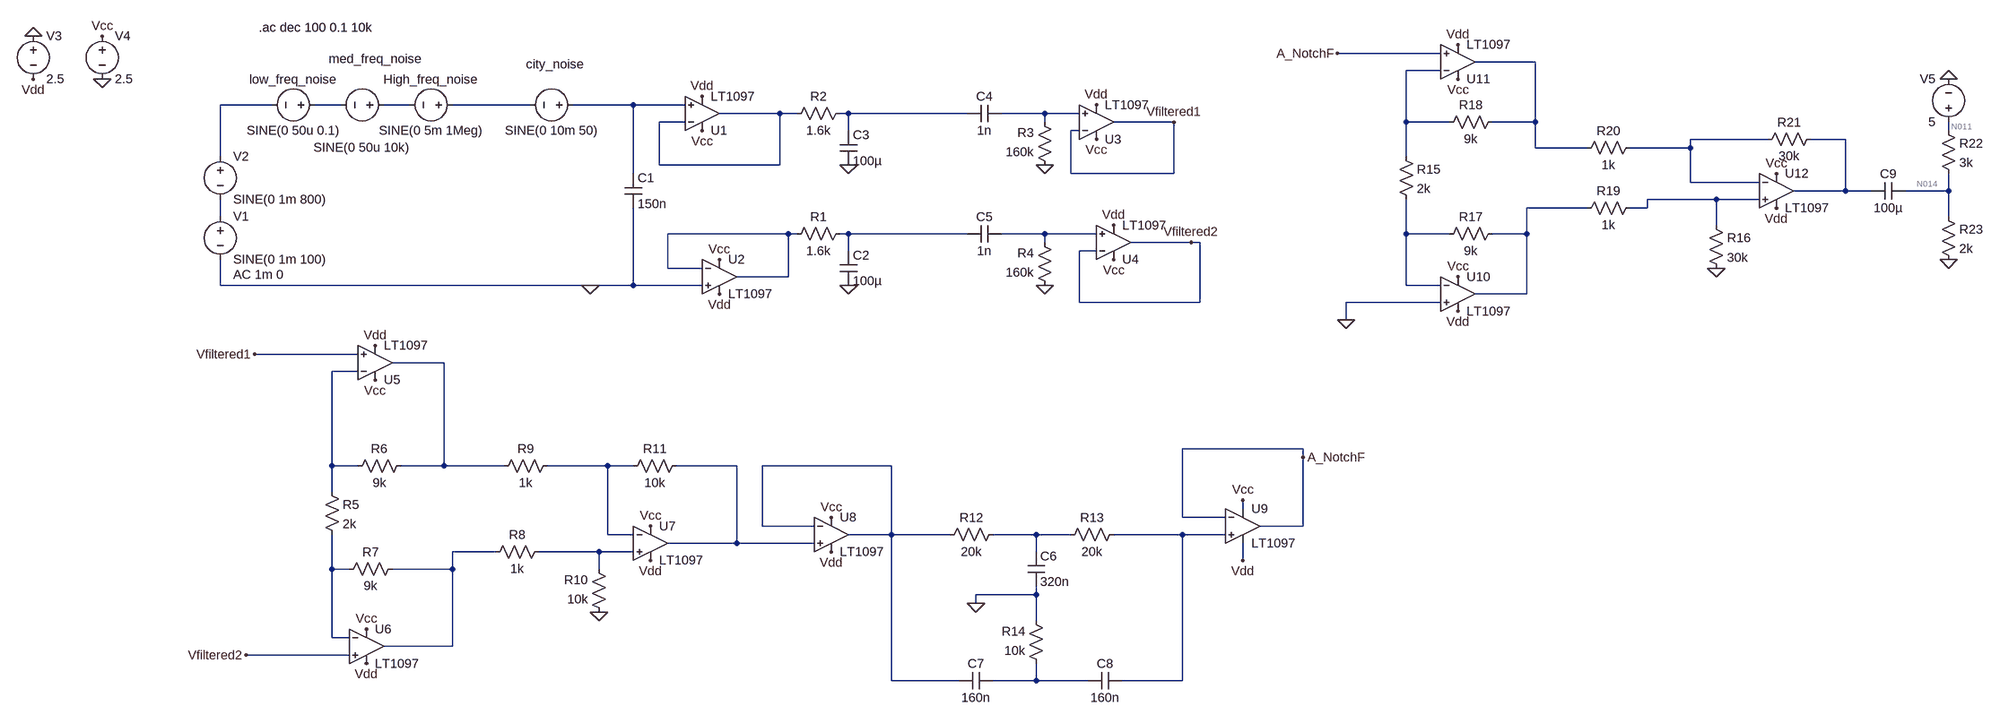
[diagram p0: schematic Frequency Response.asc]
Frequency Response.asc, the LTspice schematic file:
Version 4
SHEET 1 3220 1084
WIRE 2208 -144 2016 -144
WIRE 2384 -128 2272 -128
WIRE 2208 -112 2144 -112
WIRE 32 -48 -64 -48
WIRE 160 -48 112 -48
WIRE 288 -48 240 -48
WIRE 512 -48 368 -48
WIRE 704 -48 592 -48
WIRE 800 -48 704 -48
WIRE 976 -32 864 -32
WIRE 1008 -32 976 -32
WIRE 1104 -32 1088 -32
WIRE 1328 -32 1104 -32
WIRE 1472 -32 1392 -32
WIRE 1536 -32 1472 -32
WIRE 800 -16 752 -16
WIRE 1472 -16 1472 -32
WIRE 1712 -16 1600 -16
WIRE 2144 -16 2144 -112
WIRE 2224 -16 2144 -16
WIRE 2384 -16 2384 -128
WIRE 2384 -16 2304 -16
WIRE 1104 0 1104 -32
WIRE 1536 0 1520 0
WIRE 3152 0 3152 -16
WIRE 2816 16 2672 16
WIRE 2960 16 2896 16
WIRE 2384 32 2384 -16
WIRE 2480 32 2384 32
WIRE 2672 32 2672 16
WIRE 2672 32 2560 32
WIRE -64 48 -64 -48
WIRE 2144 48 2144 -16
WIRE 752 64 752 -16
WIRE 976 64 976 -32
WIRE 976 64 752 64
WIRE 704 80 704 -48
WIRE 1520 80 1520 0
WIRE 1712 80 1712 -16
WIRE 1712 80 1520 80
WIRE 2672 96 2672 32
WIRE 2800 96 2672 96
WIRE 2960 112 2960 16
WIRE 2960 112 2864 112
WIRE 3008 112 2960 112
WIRE 3152 112 3152 80
WIRE 3152 112 3072 112
WIRE 2720 128 2592 128
WIRE 2800 128 2720 128
WIRE 2480 144 2368 144
WIRE 2592 144 2592 128
WIRE 2592 144 2560 144
WIRE -64 160 -64 128
WIRE 3152 160 3152 112
WIRE 2720 176 2720 128
WIRE 992 192 768 192
WIRE 1008 192 992 192
WIRE 1104 192 1088 192
WIRE 1328 192 1104 192
WIRE 1472 192 1392 192
WIRE 1568 192 1472 192
WIRE 2144 192 2144 128
WIRE 2224 192 2144 192
WIRE 2368 192 2368 144
WIRE 2368 192 2304 192
WIRE 1472 208 1472 192
WIRE 1744 208 1632 208
WIRE 1760 208 1744 208
WIRE 1104 224 1104 192
WIRE 1568 224 1536 224
WIRE 768 256 768 192
WIRE 832 256 768 256
WIRE 992 272 992 192
WIRE 992 272 896 272
WIRE -64 288 -64 240
WIRE 624 288 -64 288
WIRE 704 288 704 144
WIRE 704 288 624 288
WIRE 832 288 704 288
WIRE 2144 288 2144 192
WIRE 2208 288 2144 288
WIRE 2368 304 2368 192
WIRE 2368 304 2272 304
WIRE 1536 320 1536 224
WIRE 1760 320 1760 208
WIRE 1760 320 1536 320
WIRE 2208 320 2032 320
WIRE 2032 352 2032 320
WIRE 192 416 0 416
WIRE 352 432 256 432
WIRE 192 448 144 448
WIRE 1952 592 1728 592
WIRE 1952 608 1952 592
WIRE 144 624 144 448
WIRE 192 624 144 624
WIRE 352 624 352 432
WIRE 352 624 272 624
WIRE 464 624 352 624
WIRE 656 624 544 624
WIRE 704 624 656 624
WIRE 896 624 784 624
WIRE 1184 624 944 624
WIRE 144 672 144 624
WIRE 1840 704 1840 688
WIRE 1728 720 1728 592
WIRE 1808 720 1728 720
WIRE 944 736 944 624
WIRE 1040 736 944 736
WIRE 1952 736 1952 608
WIRE 1952 736 1872 736
WIRE 656 752 656 624
WIRE 704 752 656 752
WIRE 1184 752 1184 624
WIRE 1184 752 1104 752
WIRE 1296 752 1184 752
WIRE 1456 752 1376 752
WIRE 1520 752 1456 752
WIRE 1728 752 1600 752
WIRE 1808 752 1728 752
WIRE 896 768 896 624
WIRE 896 768 768 768
WIRE 1040 768 896 768
WIRE 448 784 368 784
WIRE 640 784 528 784
WIRE 704 784 640 784
WIRE 1456 784 1456 752
WIRE 1840 800 1840 768
WIRE 144 816 144 752
WIRE 176 816 144 816
WIRE 368 816 368 784
WIRE 368 816 256 816
WIRE 640 816 640 784
WIRE 1456 864 1456 848
WIRE 1456 864 1344 864
WIRE 1344 880 1344 864
WIRE 1456 912 1456 864
WIRE 144 944 144 816
WIRE 176 944 144 944
WIRE 368 960 368 816
WIRE 368 960 240 960
WIRE 176 976 -16 976
WIRE 1184 1024 1184 752
WIRE 1312 1024 1184 1024
WIRE 1456 1024 1456 992
WIRE 1456 1024 1376 1024
WIRE 1552 1024 1456 1024
WIRE 1728 1024 1728 752
WIRE 1728 1024 1616 1024
FLAG -528 -176 0
FLAG -400 -96 0
FLAG -400 -176 Vcc
FLAG -528 -96 Vdd
FLAG 832 0 Vcc
FLAG 864 240 Vcc
FLAG 832 -64 Vdd
FLAG 864 304 Vdd
FLAG 624 288 0
FLAG 1472 288 0
FLAG 1472 64 0
FLAG 1104 64 0
FLAG 1104 288 0
FLAG 1568 16 Vcc
FLAG 1600 240 Vcc
FLAG 1568 -48 Vdd
FLAG 1600 176 Vdd
FLAG 1712 -16 Vfiltered1
FLAG 0 416 Vfiltered1
FLAG 1744 208 Vfiltered2
FLAG -16 976 Vfiltered2
FLAG 640 896 0
FLAG 736 736 Vcc
FLAG 224 400 Vdd
FLAG 208 928 Vcc
FLAG 224 464 Vcc
FLAG 208 992 Vdd
FLAG 736 800 Vdd
FLAG 1072 784 Vdd
FLAG 1072 720 Vcc
FLAG 1840 688 Vcc
FLAG 1840 800 Vdd
FLAG 1344 880 0
FLAG 2016 -144 A_NotchF
FLAG 1952 608 A_NotchF
FLAG 2032 352 0
FLAG 2240 272 Vcc
FLAG 2240 -96 Vcc
FLAG 2832 80 Vcc
FLAG 2240 -160 Vdd
FLAG 2240 336 Vdd
FLAG 2832 144 Vdd
FLAG 2720 256 0
FLAG 3152 -96 0
FLAG 3152 240 0
SYMBOL voltage -64 144 R0
WINDOW 123 24 124 Left 2
WINDOW 39 0 0 Left 0
SYMATTR Value2 AC 1m 0
SYMATTR InstName V1
SYMATTR Value SINE(0 1m 100)
SYMBOL voltage -64 32 R0
WINDOW 123 0 0 Left 0
WINDOW 39 0 0 Left 0
SYMATTR InstName V2
SYMATTR Value SINE(0 1m 800)
SYMBOL voltage 128 -48 R90
WINDOW 0 -32 56 VBottom 2
WINDOW 3 32 56 VTop 2
WINDOW 123 0 0 Left 0
WINDOW 39 0 0 Left 0
SYMATTR InstName low_freq_noise
SYMATTR Value SINE(0 50u 0.1)
SYMBOL voltage 256 -48 R90
WINDOW 0 -70 31 VBottom 2
WINDOW 3 64 57 VTop 2
WINDOW 123 0 0 Left 0
WINDOW 39 0 0 Left 0
SYMATTR InstName med_freq_noise
SYMATTR Value SINE(0 50u 10k)
SYMBOL voltage 384 -48 R90
WINDOW 0 -32 56 VBottom 2
WINDOW 3 32 56 VTop 2
WINDOW 123 0 0 Left 0
WINDOW 39 0 0 Left 0
SYMATTR InstName High_freq_noise
SYMATTR Value SINE(0 5m 1Meg)
SYMBOL voltage 608 -48 R90
WINDOW 0 -60 50 VBottom 2
WINDOW 3 32 56 VTop 2
WINDOW 123 0 0 Left 0
WINDOW 39 0 0 Left 0
SYMATTR InstName city_noise
SYMATTR Value SINE(0 10m 50)
SYMBOL cap 688 80 R0
SYMATTR InstName C1
SYMATTR Value 150n
SYMBOL voltage -528 -192 R0
SYMATTR InstName V3
SYMATTR Value 2.5
SYMBOL voltage -400 -192 R0
SYMATTR InstName V4
SYMATTR Value 2.5
SYMBOL OpAmps\\LT1097 832 32 M180
SYMATTR InstName U1
SYMBOL OpAmps\\LT1097 864 208 R0
SYMATTR InstName U2
SYMBOL cap 1088 224 R0
SYMATTR InstName C2
SYMATTR Value 100µ
SYMBOL cap 1088 0 R0
SYMATTR InstName C3
SYMATTR Value 100µ
SYMBOL cap 1392 -48 R90
WINDOW 0 0 32 VBottom 2
WINDOW 3 32 32 VTop 2
SYMATTR InstName C4
SYMATTR Value 1n
SYMBOL cap 1392 176 R90
WINDOW 0 0 32 VBottom 2
WINDOW 3 32 32 VTop 2
SYMATTR InstName C5
SYMATTR Value 1n
SYMBOL res 1104 176 R90
WINDOW 0 0 56 VBottom 2
WINDOW 3 32 56 VTop 2
SYMATTR InstName R1
SYMATTR Value 1.6k
SYMBOL res 1104 -48 R90
WINDOW 0 0 56 VBottom 2
WINDOW 3 32 56 VTop 2
SYMATTR InstName R2
SYMATTR Value 1.6k
SYMBOL res 1488 80 R180
WINDOW 0 36 76 Left 2
WINDOW 3 36 40 Left 2
SYMATTR InstName R3
SYMATTR Value 160k
SYMBOL res 1488 304 R180
WINDOW 0 36 76 Left 2
WINDOW 3 36 40 Left 2
SYMATTR InstName R4
SYMATTR Value 160k
SYMBOL OpAmps\\LT1097 1568 48 M180
SYMATTR InstName U3
SYMBOL OpAmps\\LT1097 1600 272 M180
SYMATTR InstName U4
SYMBOL OpAmps\\LT1097 224 496 M180
SYMATTR InstName U5
SYMBOL OpAmps\\LT1097 208 896 R0
SYMATTR InstName U6
SYMBOL OpAmps\\LT1097 736 704 R0
SYMATTR InstName U7
SYMBOL res 128 656 R0
SYMATTR InstName R5
SYMATTR Value 2k
SYMBOL res 288 608 R90
WINDOW 0 0 56 VBottom 2
WINDOW 3 32 56 VTop 2
SYMATTR InstName R6
SYMATTR Value 9k
SYMBOL res 272 800 R90
WINDOW 0 0 56 VBottom 2
WINDOW 3 32 56 VTop 2
SYMATTR InstName R7
SYMATTR Value 9k
SYMBOL res 544 768 R90
WINDOW 0 0 56 VBottom 2
WINDOW 3 32 56 VTop 2
SYMATTR InstName R8
SYMATTR Value 1k
SYMBOL res 560 608 R90
WINDOW 0 0 56 VBottom 2
WINDOW 3 32 56 VTop 2
SYMATTR InstName R9
SYMATTR Value 1k
SYMBOL res 656 912 R180
WINDOW 0 36 76 Left 2
WINDOW 3 36 40 Left 2
SYMATTR InstName R10
SYMATTR Value 10k
SYMBOL res 688 640 R270
WINDOW 0 32 56 VTop 2
WINDOW 3 0 56 VBottom 2
SYMATTR InstName R11
SYMATTR Value 10k
SYMBOL OpAmps\\LT1097 1072 688 R0
SYMATTR InstName U8
SYMBOL res 1392 736 R90
WINDOW 0 0 56 VBottom 2
WINDOW 3 32 56 VTop 2
SYMATTR InstName R12
SYMATTR Value 20k
SYMBOL res 1616 736 R90
WINDOW 0 0 56 VBottom 2
WINDOW 3 32 56 VTop 2
SYMATTR InstName R13
SYMATTR Value 20k
SYMBOL res 1472 1008 R180
WINDOW 0 36 76 Left 2
WINDOW 3 36 40 Left 2
SYMATTR InstName R14
SYMATTR Value 10k
SYMBOL cap 1440 784 R0
SYMATTR InstName C6
SYMATTR Value 320n
SYMBOL cap 1376 1008 R90
WINDOW 0 0 32 VBottom 2
WINDOW 3 32 32 VTop 2
SYMATTR InstName C7
SYMATTR Value 160n
SYMBOL cap 1616 1008 R90
WINDOW 0 0 32 VBottom 2
WINDOW 3 32 32 VTop 2
SYMATTR InstName C8
SYMATTR Value 160n
SYMBOL OpAmps\\LT1097 1840 672 R0
SYMATTR InstName U9
SYMBOL OpAmps\\LT1097 2240 240 R0
SYMATTR InstName U10
SYMBOL OpAmps\\LT1097 2240 -64 M180
SYMATTR InstName U11
SYMBOL OpAmps\\LT1097 2832 48 R0
SYMATTR InstName U12
SYMBOL res 2128 32 R0
SYMATTR InstName R15
SYMATTR Value 2k
SYMBOL res 2704 160 R0
SYMATTR InstName R16
SYMATTR Value 30k
SYMBOL res 2320 176 R90
WINDOW 0 0 56 VBottom 2
WINDOW 3 32 56 VTop 2
SYMATTR InstName R17
SYMATTR Value 9k
SYMBOL res 2320 -32 R90
WINDOW 0 0 56 VBottom 2
WINDOW 3 32 56 VTop 2
SYMATTR InstName R18
SYMATTR Value 9k
SYMBOL res 2576 128 R90
WINDOW 0 0 56 VBottom 2
WINDOW 3 32 56 VTop 2
SYMATTR InstName R19
SYMATTR Value 1k
SYMBOL res 2576 16 R90
WINDOW 0 0 56 VBottom 2
WINDOW 3 32 56 VTop 2
SYMATTR InstName R20
SYMATTR Value 1k
SYMBOL res 2912 0 R90
WINDOW 0 0 56 VBottom 2
WINDOW 3 32 56 VTop 2
SYMATTR InstName R21
SYMATTR Value 30k
SYMBOL voltage 3152 0 R180
WINDOW 0 24 96 Left 2
WINDOW 3 24 16 Left 2
SYMATTR InstName V5
SYMATTR Value 5
SYMBOL res 3136 -16 R0
SYMATTR InstName R22
SYMATTR Value 3k
SYMBOL res 3136 144 R0
SYMATTR InstName R23
SYMATTR Value 2k
SYMBOL cap 3072 96 R90
WINDOW 0 0 32 VBottom 2
WINDOW 3 32 32 VTop 2
SYMATTR InstName C9
SYMATTR Value 100µ
TEXT 8 -192 Left 2 !.ac dec 100 0.1 10k

The netlist it stands for:
* Frequency Response.asc
V1 N017 0 SINE(0 1m 100) AC 1m 0
V2 N003 N017 SINE(0 1m 800)
V§low_freq_noise N004 N003 SINE(0 50u 0.1)
V§med_freq_noise N005 N004 SINE(0 50u 10k)
V§High_freq_noise N006 N005 SINE(0 5m 1Meg)
V§city_noise N007 N006 SINE(0 10m 50)
C1 N007 0 150n
V3 0 Vdd 2.5
V4 Vcc 0 2.5
XU1 N007 N008 Vcc Vdd N008 LT1097  ; pins In+ In- V+ V- OUT
XU2 0 N018 Vcc Vdd N018 LT1097  ; pins In+ In- V+ V- OUT
C2 N019 0 100µ
C3 N009 0 100µ
C4 N010 N009 1n
C5 N020 N019 1n
R1 N019 N018 1.6k
R2 N009 N008 1.6k
R3 0 N010 160k
R4 0 N020 160k
XU3 N010 Vfiltered1 Vcc Vdd Vfiltered1 LT1097  ; pins In+ In- V+ V- OUT
XU4 N020 Vfiltered2 Vcc Vdd Vfiltered2 LT1097  ; pins In+ In- V+ V- OUT
XU5 Vfiltered1 N023 Vcc Vdd N022 LT1097  ; pins In+ In- V+ V- OUT
XU6 Vfiltered2 N031 Vcc Vdd N029 LT1097  ; pins In+ In- V+ V- OUT
XU7 N030 N024 Vcc Vdd N025 LT1097  ; pins In+ In- V+ V- OUT
R5 N023 N031 2k
R6 N022 N023 9k
R7 N029 N031 9k
R8 N030 N029 1k
R9 N024 N022 1k
R10 0 N030 10k
R11 N024 N025 10k
XU8 N025 N026 Vcc Vdd N026 LT1097  ; pins In+ In- V+ V- OUT
R12 N027 N026 20k
R13 N028 N027 20k
R14 N032 0 10k
C6 N027 0 320n
C7 N032 N026 160n
C8 N028 N032 160n
XU9 N028 A_NotchF Vcc Vdd A_NotchF LT1097  ; pins In+ In- V+ V- OUT
XU10 0 N021 Vcc Vdd N016 LT1097  ; pins In+ In- V+ V- OUT
XU11 A_NotchF N002 Vcc Vdd N001 LT1097  ; pins In+ In- V+ V- OUT
XU12 N015 N012 Vcc Vdd N013 LT1097  ; pins In+ In- V+ V- OUT
R15 N002 N021 2k
R16 N015 0 30k
R17 N016 N021 9k
R18 N001 N002 9k
R19 N015 N016 1k
R20 N012 N001 1k
R21 N013 N012 30k
V5 N011 0 5
R22 N011 N014 3k
R23 N014 0 2k
C9 N014 N013 100µ
.ac dec 100 0.1 10k
.backanno
.end

* Results of the author's LTspice run, read from the files saved beside the schematic
* Operating Point, zero values left out:
*   V(vdd) = -2.5 V
*   V(vcc) = 2.5 V
*   V(n011) = 5 V
*   V(n014) = 2 V
*   I(R23) = 1 mA
*   I(R22) = 1 mA
*   I(V5) = -1 mA
*   I(V4) = -4.198 mA
*   I(V3) = -4.198 mA
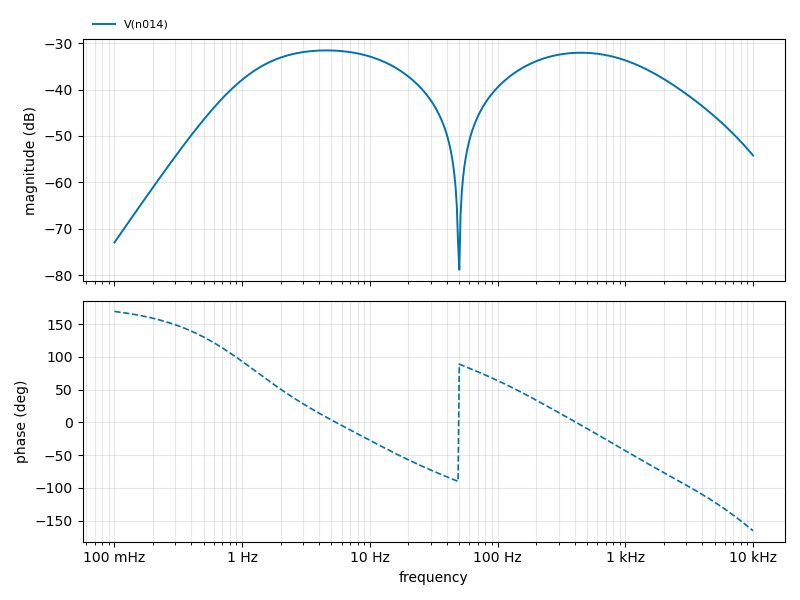
[diagram p1: AC Analysis of Frequency Response.asc, plotted from the saved traces]
* AC Analysis, 1 run:
*   V(n014): -72.93 dB at 100 mHz, -54.20 dB at 10 kHz, peak -31.57 dB at 4.571 Hz, 3 dB below the peak at 1.508 Hz and 14.21 Hz